# EAGLE schematic IO V1.0 (EAGLE 9.6.2)

## Sheet 1 of 6: BUS
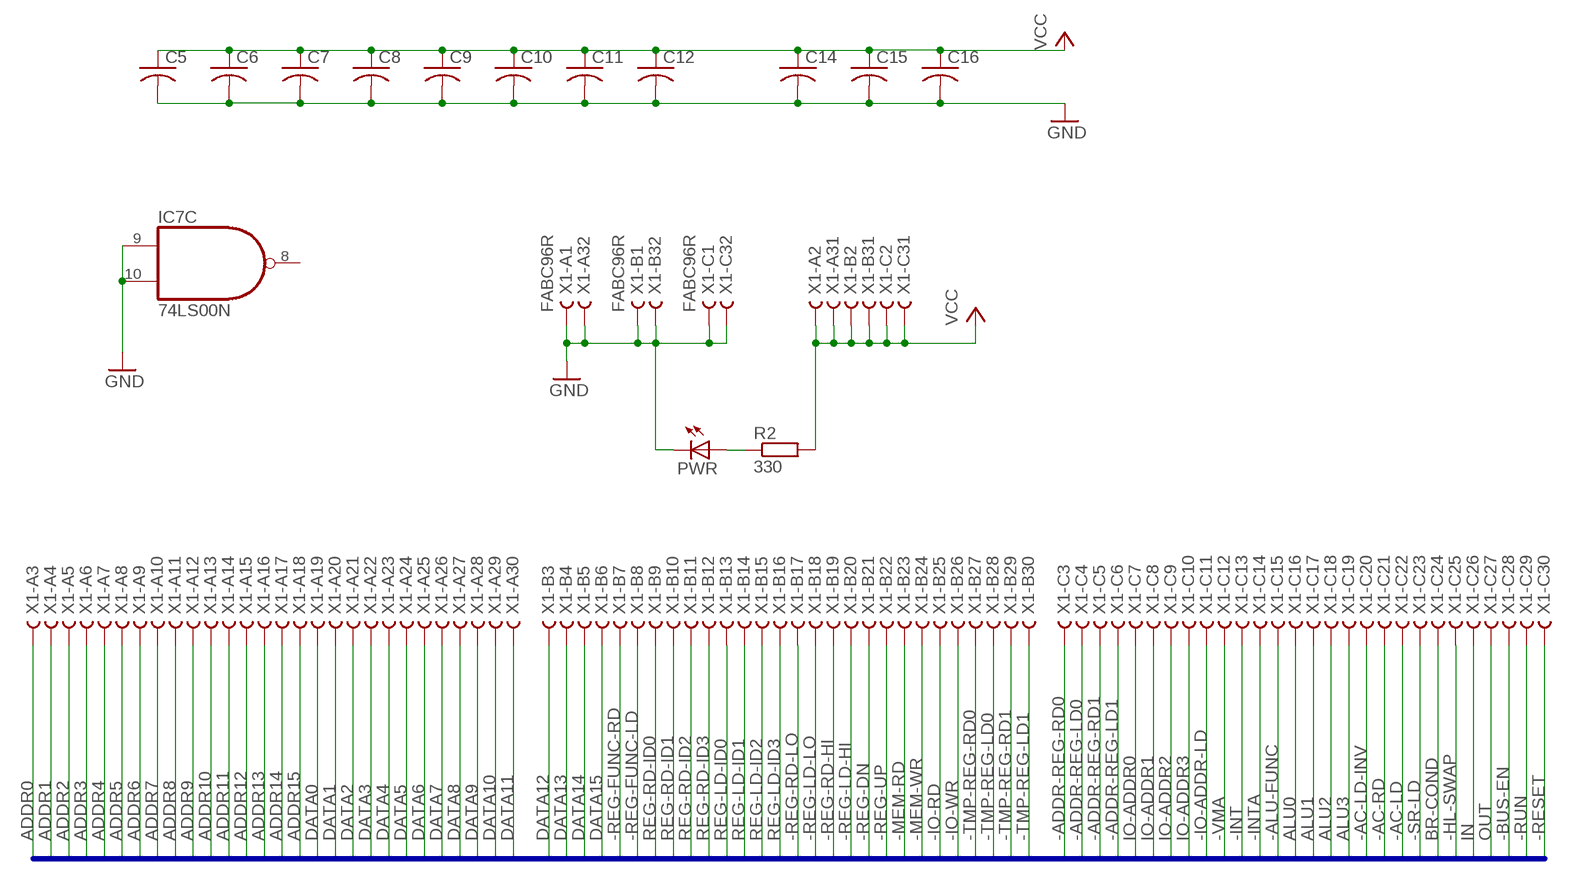
[diagram p0: schematic, sheet 1]

### Parts
C5  C-US025-024X044  [C025-024X044]
C6  C-US025-024X044  [C025-024X044]
C7  C-US025-024X044  [C025-024X044]
C8  C-US025-024X044  [C025-024X044]
C9  C-US025-024X044  [C025-024X044]
C10  C-US025-024X044  [C025-024X044]
C11  C-US025-024X044  [C025-024X044]
C12  C-US025-024X044  [C025-024X044]
C14  C-US025-024X044  [C025-024X044]
C15  C-US025-024X044  [C025-024X044]
C16  C-US025-024X044  [C025-024X044]
IC7  74LS00N  [DIL14]
PWR  LED5MM  [LED5MM]
R2  330  R0207/10  [0207/10]
X1  FABC96R  [FABC96R]

### Nets
-AC-LD: X1.C22
-AC-LD-INV: X1.C20
-AC-RD: X1.C21
-ADDR-REG-LD0: X1.C4
-ADDR-REG-LD1: X1.C6
-ADDR-REG-RD0: X1.C3
-ADDR-REG-RD1: X1.C5
-ALU-FUNC: X1.C15
-BUS-EN: X1.C28
-HL-SWAP: X1.C25
-INT: X1.C13 ; also sheet 2
-INTA: X1.C14
-IO-ADDR-LD: X1.C11
-IO-RD: X1.B25 ; also sheet 6
-IO-WR: X1.B26 ; also sheet 6
-MEM-RD: X1.B23
-MEM-WR: X1.B24
-REG-DN: X1.B21
-REG-FUNC-LD: X1.B8
-REG-FUNC-RD: X1.B7
-REG-LD-HI: X1.B20
-REG-LD-LO: X1.B18
-REG-RD-HI: X1.B19
-REG-RD-LO: X1.B17
-REG-UP: X1.B22
-RESET: X1.C30 ; also sheet 6
-RUN: X1.C29
-SR-LD: X1.C23
-TMP-REG-LD0: X1.B28
-TMP-REG-LD1: X1.B30
-TMP-REG-RD0: X1.B27
-TMP-REG-RD1: X1.B29
-VMA: X1.C12
ADDR0: X1.A3
ADDR1: X1.A4
ADDR2: X1.A5
ADDR3: X1.A6
ADDR4: X1.A7
ADDR5: X1.A8
ADDR6: X1.A9
ADDR7: X1.A10
ADDR8: X1.A11
ADDR9: X1.A12
ADDR10: X1.A13
ADDR11: X1.A14
ADDR12: X1.A15
ADDR13: X1.A16
ADDR14: X1.A17
ADDR15: X1.A18
ALU0: X1.C16
ALU1: X1.C17
ALU2: X1.C18
ALU3: X1.C19
BR-COND: X1.C24
DATA0: X1.A19 ; also sheet 2,3,4,5
DATA1: X1.A20 ; also sheet 2,3,4,5
DATA2: X1.A21 ; also sheet 2,3,4,5
DATA3: X1.A22 ; also sheet 2,3,4,5
DATA4: X1.A23 ; also sheet 2,3,4,5
DATA5: X1.A24 ; also sheet 2,3,4,5
DATA6: X1.A25 ; also sheet 2,3,4,5
DATA7: X1.A26 ; also sheet 2,3,4,5
DATA8: X1.A27
DATA9: X1.A28
DATA10: X1.A29
DATA11: X1.A30
DATA12: X1.B3
DATA13: X1.B4
DATA14: X1.B5
DATA15: X1.B6
GND: C5.2 C6.2 C7.2 C8.2 C9.2 C10.2 C11.2 C12.2 C14.2 C15.2 C16.2 IC7.9(C:I0) IC7.10(C:I1) PWR.K(C) X1.A1 X1.A32 X1.B1 X1.B32 X1.C1 X1.C32 ; also sheet 2,3,4,5
IN: X1.C26 ; also sheet 4
IO-ADDR0: X1.C7 ; also sheet 5
IO-ADDR1: X1.C8 ; also sheet 5
IO-ADDR2: X1.C9 ; also sheet 5
IO-ADDR3: X1.C10 ; also sheet 5
N$11: PWR.A R2.1
OUT: X1.C27 ; also sheet 3
REG-LD-ID0: X1.B13
REG-LD-ID1: X1.B14
REG-LD-ID2: X1.B15
REG-LD-ID3: X1.B16
REG-RD-ID0: X1.B9
REG-RD-ID1: X1.B10
REG-RD-ID2: X1.B11
REG-RD-ID3: X1.B12
VCC: C5.1 C6.1 C7.1 C8.1 C9.1 C10.1 C11.1 C12.1 C14.1 C15.1 C16.1 R2.2 X1.A2 X1.A31 X1.B2 X1.B31 X1.C2 X1.C31 ; also sheet 2,3,4,5,6
Unconnected: IC7.8(C:O)

### Buses
-AC-LD,-AC-LD-INV,-AC-RD,ADDR[0..15],-ADDR-REG-LD[0..1],-ADDR-REG-RD[0..1],ALU[0..3],-ALU-FUNC,BR-COND,-BUS-EN,DATA[0..15],-HL-SWAP,IN,-INT,-INTA,IO-ADDR[0..3],-IO-ADDR-LD,-IO-RD,-IO-WR,-MEM-RD,-MEM-WR,OUT,-REG-DN,-REG-FUNC-LD,-REG-FUNC-RD,-REG-LD-HI,REG-LD-ID[0..3],-REG-LD-LO,-REG-RD-HI,REG-RD-ID[0..3],-REG-RD-LO,-REG-UP,-RESET,-RUN,-SR-LD,-TMP-REG-LD[0..1],-TMP-REG-RD[0..1],-VMA

## Sheet 2 of 6: Serial Interface
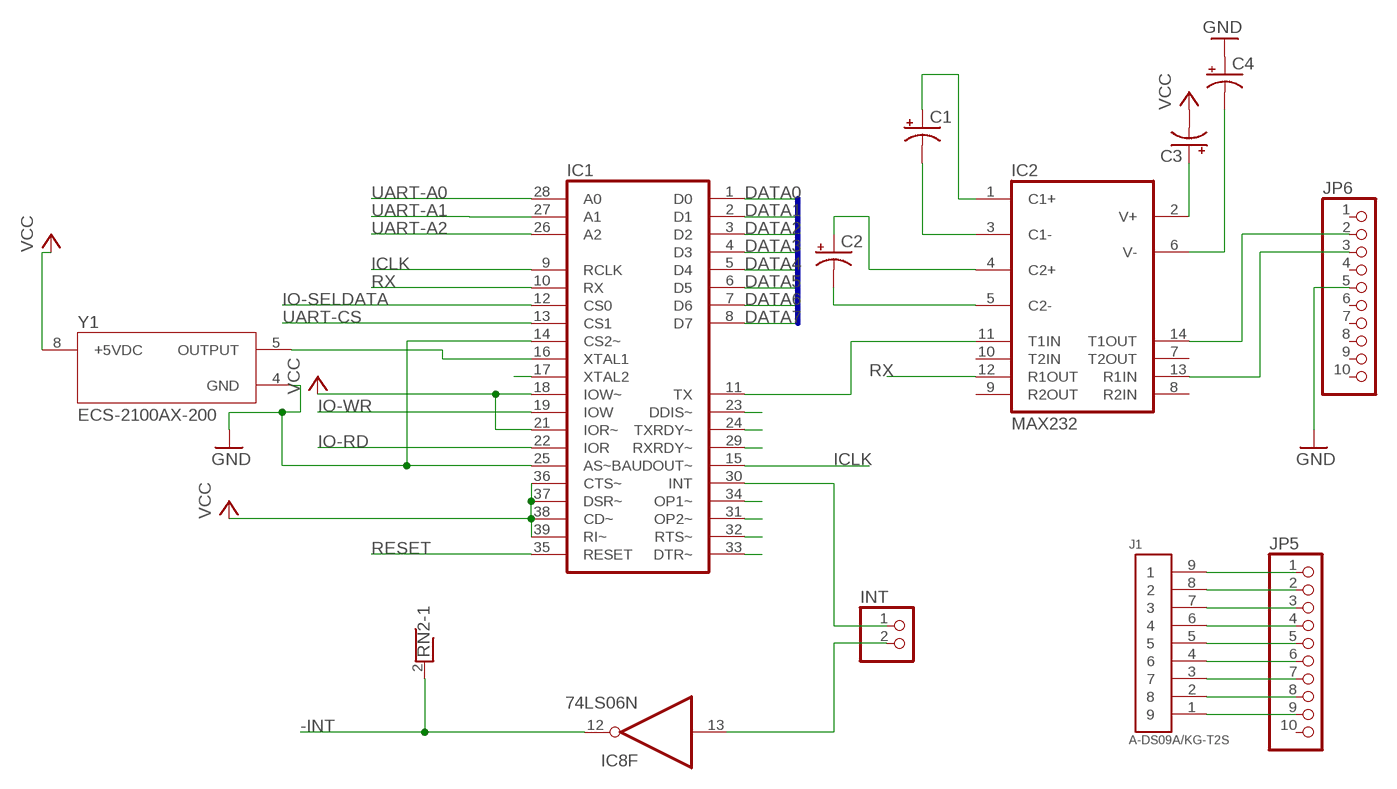
[diagram p1: schematic, sheet 2]

### Parts
C1  CPOL-USE2,5-6E  [E2,5-6E]
C2  CPOL-USE2,5-6E  [E2,5-6E]
C3  CPOL-USE2,5-6E  [E2,5-6E]
C4  CPOL-USE2,5-6E  [E2,5-6E]
IC1  XR-16C550P  [DIL40]
IC2  MAX232  [DIL16]
IC8  74LS06N  [DIL14]
INT  PINHD-1X2  [1X02]
J1  A-DS09A/KG-T2S  [A-DS09A/KG-T2S]
JP5  PINHD-1X10  [1X10]
JP6  PINHD-1X10  [1X10]
RN2  RNX6  [RN-7]
Y1  ECS-2100AX-200  [ECS-2100AX-200]

### Nets
-INT: IC8.12(F:O) RN2.2 ; also sheet 1
DATA0: IC1.1(D0) ; also sheet 1,3,4,5
DATA1: IC1.2(D1) ; also sheet 1,3,4,5
DATA2: IC1.3(D2) ; also sheet 1,3,4,5
DATA3: IC1.4(D3) ; also sheet 1,3,4,5
DATA4: IC1.5(D4) ; also sheet 1,3,4,5
DATA5: IC1.6(D5) ; also sheet 1,3,4,5
DATA6: IC1.7(D6) ; also sheet 1,3,4,5
DATA7: IC1.8(D7) ; also sheet 1,3,4,5
GND: C4.+ IC1.14(CS2~) IC1.25(AS~) JP6.5 Y1.4(GND) ; also sheet 1,3,4,5
ICLK: IC1.9(RCLK) IC1.15(BAUDOUT~)
IO-RD: IC1.22(IOR) ; also sheet 4,6
IO-SELDATA: IC1.12(CS0) ; also sheet 3,4,5
IO-WR: IC1.19(IOW) ; also sheet 3,5,6
N$31: IC1.16(XTAL1) Y1.5(OUTPUT)
N$35: J1.9 JP5.1
N$36: J1.8 JP5.2
N$37: IC1.11(TX) IC2.11(T1IN)
N$38: J1.7 JP5.3
N$39: J1.6 JP5.4
N$42: J1.5 JP5.5
N$43: J1.4 JP5.6
N$45: J1.3 JP5.7
N$47: J1.2 JP5.8
N$48: J1.1 JP5.9
N$49: IC2.14(T1OUT) JP6.2
N$50: IC2.13(R1IN) JP6.3
N$51: C2.- IC2.5(C2-)
N$52: C2.+ IC2.4(C2+)
N$53: IC1.31(OP2~)
N$54: IC1.32(RTS~)
N$55: IC1.33(DTR~)
N$56: IC1.34(OP1~)
N$57: IC1.30(INT) INT.1
N$58: IC1.23(DDIS~)
N$59: IC1.24(TXRDY~)
N$60: IC1.29(RXRDY~)
N$61: IC1.17(XTAL2)
N$62: C1.- IC2.3(C1-)
N$63: C1.+ IC2.1(C1+)
N$64: C3.+ IC2.2(V+)
N$65: C4.- IC2.6(V-)
N$66: IC8.13(F:I) INT.2
RESET: IC1.35(RESET) ; also sheet 6
RX: IC1.10(RX) IC2.12(R1OUT)
UART-A0: IC1.28(A0) ; also sheet 5
UART-A1: IC1.27(A1) ; also sheet 5
UART-A2: IC1.26(A2) ; also sheet 5
UART-CS: IC1.13(CS1) ; also sheet 5
VCC: C3.- IC1.18(IOW~) IC1.21(IOR~) IC1.36(CTS~) IC1.37(DSR~) IC1.38(CD~) IC1.39(RI~) Y1.8(+5VDC) ; also sheet 1,3,4,5,6
Unconnected: IC2.7(T2OUT) IC2.8(R2IN) IC2.9(R2OUT) IC2.10(T2IN) JP5.10 JP6.1 JP6.4 JP6.6 JP6.7 JP6.8 JP6.9 JP6.10

### Buses
DATABUS:DATA[0..15]

## Sheet 3 of 6: Output
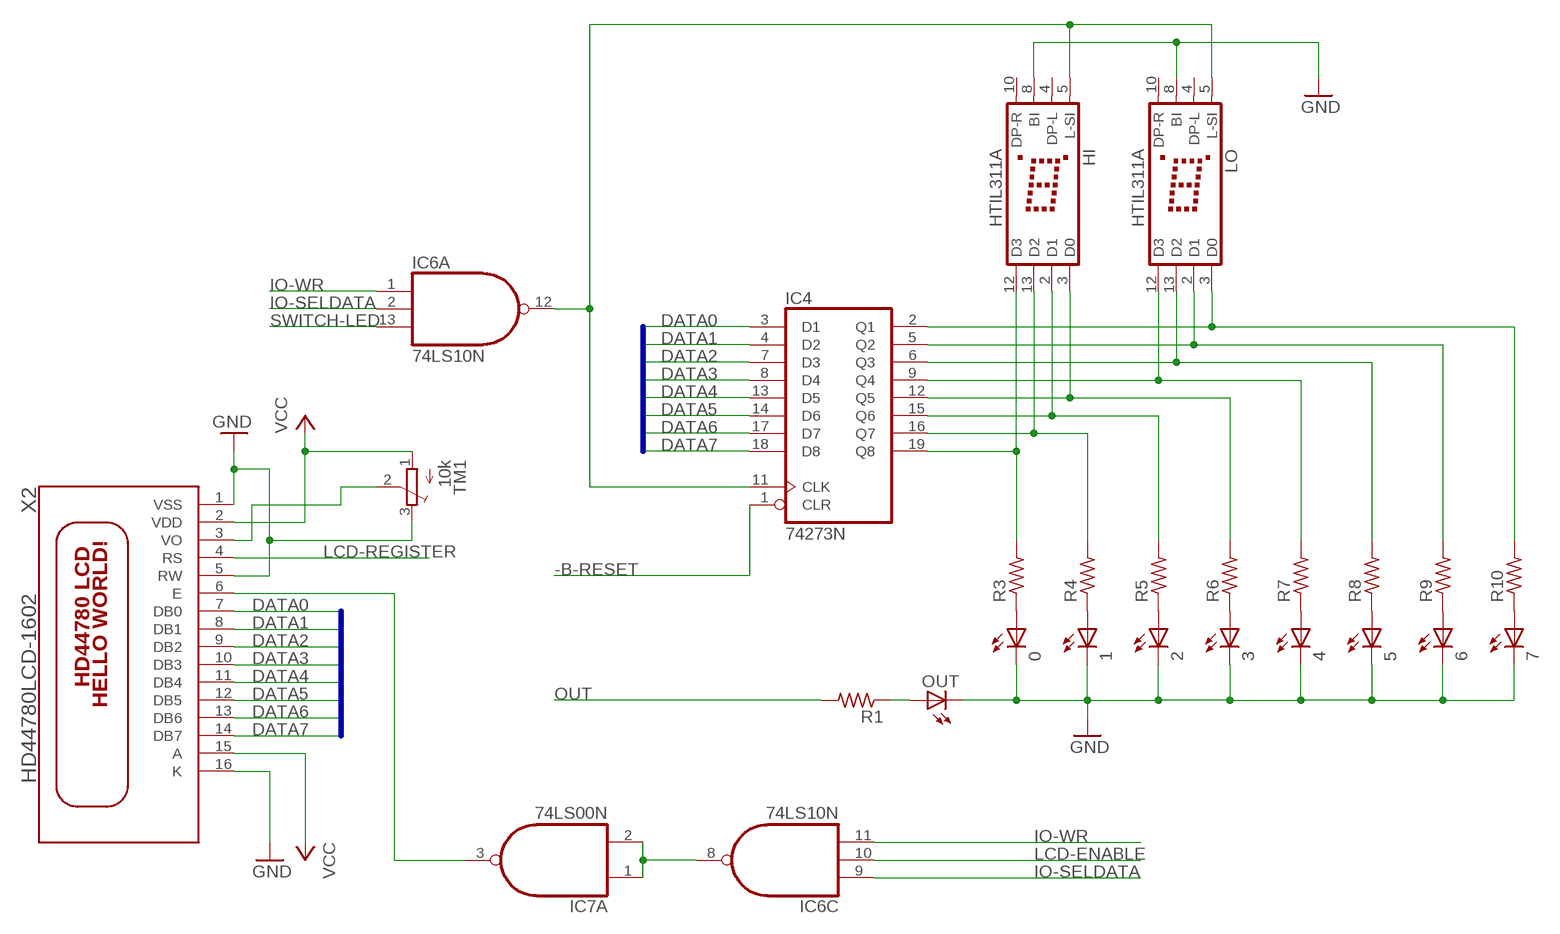
[diagram p2: schematic, sheet 3]

### Parts
0  LED5MM  [LED5MM]
1  LED5MM  [LED5MM]
2  LED5MM  [LED5MM]
3  LED5MM  [LED5MM]
4  LED5MM  [LED5MM]
5  LED5MM  [LED5MM]
6  LED5MM  [LED5MM]
7  LED5MM  [LED5MM]
HI  HTIL311A  [HTIL311A]
IC4  74273N  [DIL20]
IC6  74LS10N  [DIL14]
LO  HTIL311A  [HTIL311A]
OUT  LED5MM  [LED5MM]
R1  R-US_0207/10  [0207/10]
R3  R-US_0207/10  [0207/10]
R4  R-US_0207/10  [0207/10]
R5  R-US_0207/10  [0207/10]
R6  R-US_0207/10  [0207/10]
R7  R-US_0207/10  [0207/10]
R8  R-US_0207/10  [0207/10]
R9  R-US_0207/10  [0207/10]
R10  R-US_0207/10  [0207/10]
TM1  10k  TRIMPOT3386  [TRIM-3386]
X2  HD44780LCD-1602  [LCD1602]

### Nets
-B-RESET: IC4.1(CLR) ; also sheet 5,6
DATA0: IC4.3(D1) X2.7(DB0) ; also sheet 1,2,4,5
DATA1: IC4.4(D2) X2.8(DB1) ; also sheet 1,2,4,5
DATA2: IC4.7(D3) X2.9(DB2) ; also sheet 1,2,4,5
DATA3: IC4.8(D4) X2.10(DB3) ; also sheet 1,2,4,5
DATA4: IC4.13(D5) X2.11(DB4) ; also sheet 1,2,4,5
DATA5: IC4.14(D6) X2.12(DB5) ; also sheet 1,2,4,5
DATA6: IC4.17(D7) X2.13(DB6) ; also sheet 1,2,4,5
DATA7: IC4.18(D8) X2.14(DB7) ; also sheet 1,2,4,5
GND: 0.K(C) 1.K(C) 2.K(C) 3.K(C) 4.K(C) 5.K(C) 6.K(C) 7.K(C) HI.8(BI) LO.8(BI) OUT.K(C) TM1.3(E) X2.1(VSS) X2.5(RW) X2.16(K) ; also sheet 1,2,4,5
IO-SELDATA: IC6.2(A:I1) IC6.9(C:I0) ; also sheet 2,4,5
IO-WR: IC6.1(A:I0) IC6.11(C:I2) ; also sheet 2,5,6
LCD-ENABLE: IC6.10(C:I1) ; also sheet 5
LCD-REGISTER: X2.4(RS) ; also sheet 5
N$9: OUT.A R1.1
N$10: 2.A R5.1
N$12: 3.A R6.1
N$13: 4.A R7.1
N$14: 0.A R3.1
N$15: 1.A R4.1
N$16: 5.A R8.1
N$17: 7.A R10.1
N$18: 6.A R9.1
N$19: HI.12(D3) IC4.19(Q8) R3.2
N$20: HI.13(D2) IC4.16(Q7) R4.2
N$21: HI.2(D1) IC4.15(Q6) R5.2
N$22: HI.3(D0) IC4.12(Q5) R6.2
N$23: IC4.9(Q4) LO.12(D3) R7.2
N$24: IC4.6(Q3) LO.13(D2) R8.2
N$25: IC4.5(Q2) LO.2(D1) R9.2
N$26: IC4.2(Q1) LO.3(D0) R10.2
N$28: HI.5(L-SI) IC4.11(CLK) IC6.12(A:O) LO.5(L-SI)
N$30: IC7.3(A:O) X2.6(E)
N$33: IC6.8(C:O) IC7.1(A:I0) IC7.2(A:I1)
N$44: TM1.2(S) X2.3(VO)
OUT: R1.2 ; also sheet 1
SWITCH-LED: IC6.13(A:I2) ; also sheet 4,5
VCC: TM1.1(A) X2.2(VDD) X2.15(A) ; also sheet 1,2,4,5,6
Unconnected: HI.1(LEDSUP) HI.4(DP-L) HI.10(DP-R) LO.1(LEDSUP) LO.4(DP-L) LO.10(DP-R)

### Buses
DATABUS:DATA[0..15]

## Sheet 4 of 6: Input
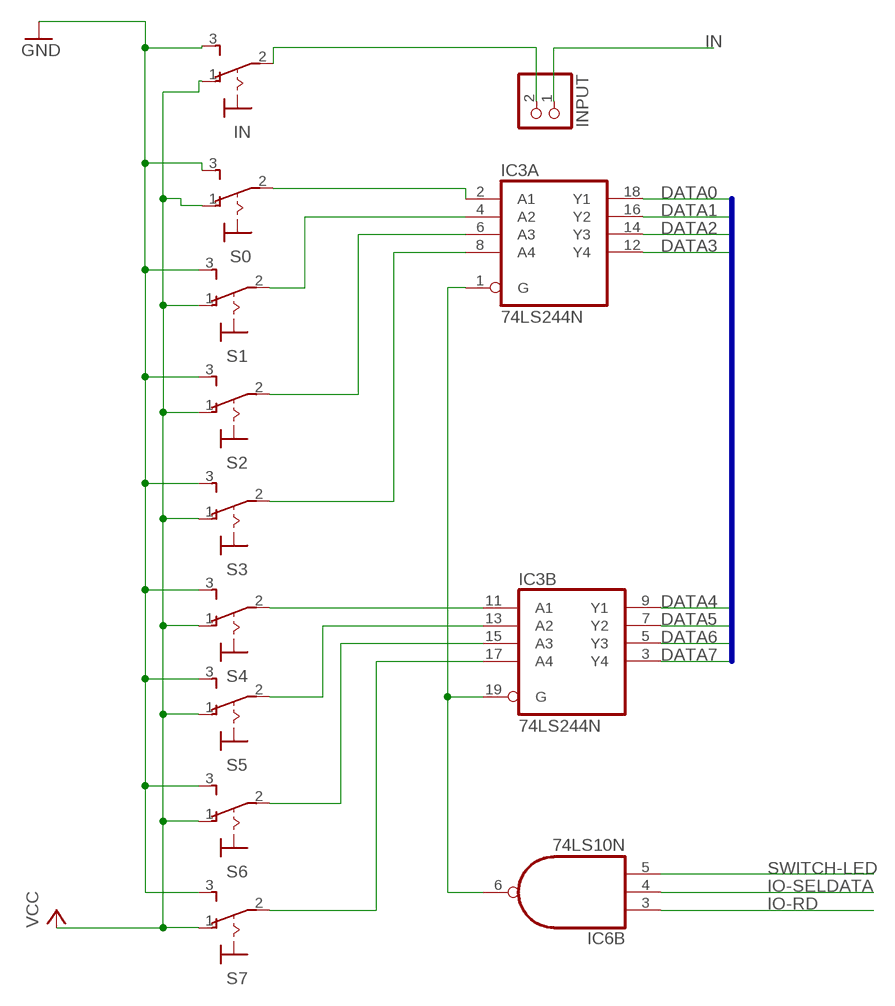
[diagram p3: schematic, sheet 4]

### Parts
IC3  74LS244N  [DIL20]
IN  M9040P  [M9040P]
INPUT  PINHD-1X2  [1X02]
S0  M9040P  [M9040P]
S1  M9040P  [M9040P]
S2  M9040P  [M9040P]
S3  M9040P  [M9040P]
S4  M9040P  [M9040P]
S5  M9040P  [M9040P]
S6  M9040P  [M9040P]
S7  M9040P  [M9040P]

### Nets
DATA0: IC3.18(A:Y1) ; also sheet 1,2,3,5
DATA1: IC3.16(A:Y2) ; also sheet 1,2,3,5
DATA2: IC3.14(A:Y3) ; also sheet 1,2,3,5
DATA3: IC3.12(A:Y4) ; also sheet 1,2,3,5
DATA4: IC3.9(B:Y1) ; also sheet 1,2,3,5
DATA5: IC3.7(B:Y2) ; also sheet 1,2,3,5
DATA6: IC3.5(B:Y3) ; also sheet 1,2,3,5
DATA7: IC3.3(B:Y4) ; also sheet 1,2,3,5
GND: IN.3(S) S0.3(S) S1.3(S) S2.3(S) S3.3(S) S4.3(S) S5.3(S) S6.3(S) S7.3(S) ; also sheet 1,2,3,5
IN: INPUT.1 ; also sheet 1
IO-RD: IC6.3(B:I0) ; also sheet 2,6
IO-SELDATA: IC6.4(B:I1) ; also sheet 2,3,5
N$1: IC3.2(A:A1) S0.2(P)
N$2: IC3.4(A:A2) S1.2(P)
N$3: IC3.6(A:A3) S2.2(P)
N$4: IC3.8(A:A4) S3.2(P)
N$5: IC3.11(B:A1) S4.2(P)
N$6: IC3.13(B:A2) S5.2(P)
N$7: IC3.15(B:A3) S6.2(P)
N$8: IC3.17(B:A4) S7.2(P)
N$32: IC3.1(A:G) IC3.19(B:G) IC6.6(B:O)
N$34: IN.2(P) INPUT.2
SWITCH-LED: IC6.5(B:I2) ; also sheet 3,5
VCC: IN.1(O) S0.1(O) S1.1(O) S2.1(O) S3.1(O) S4.1(O) S5.1(O) S6.1(O) S7.1(O) ; also sheet 1,2,3,5,6

### Buses
DATABUS:DATA[0..15]

## Sheet 5 of 6: Board Select logic
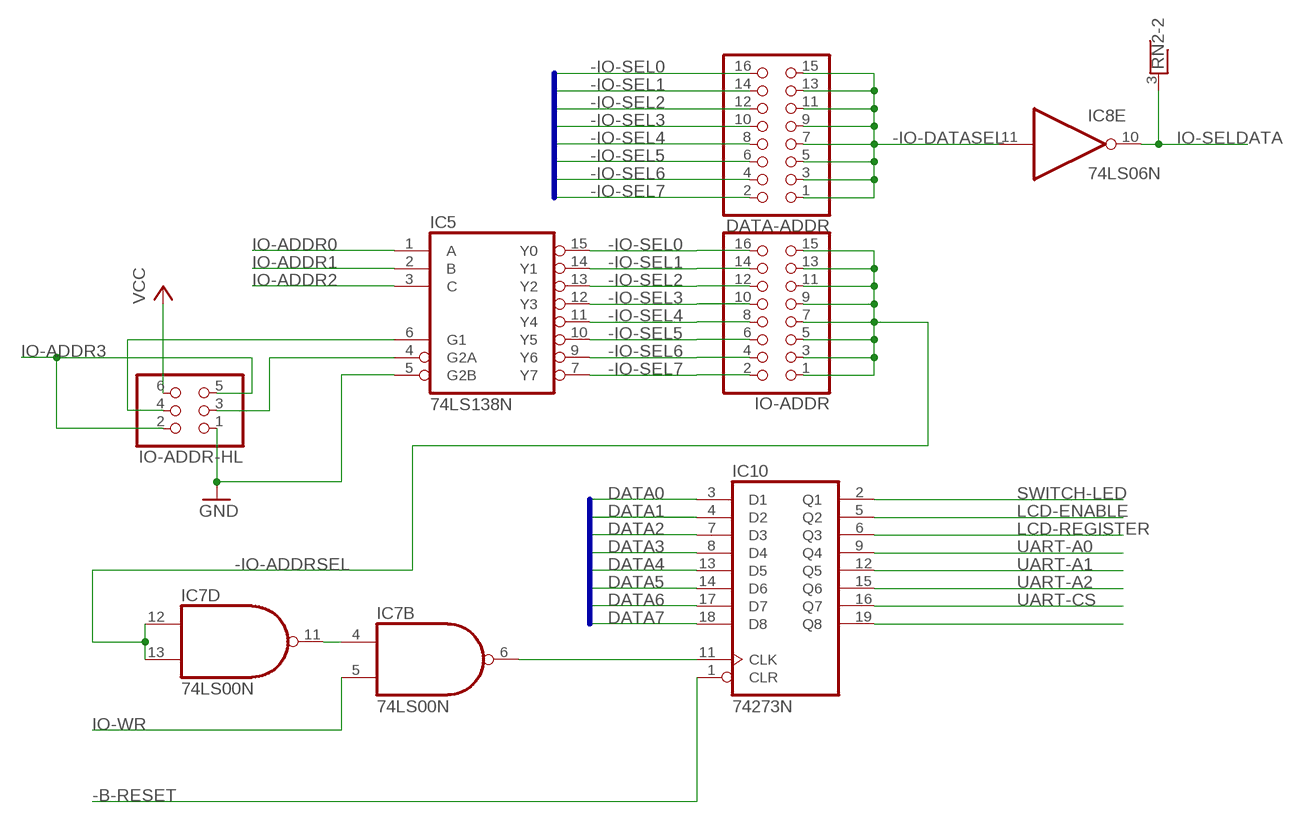
[diagram p4: schematic, sheet 5]

### Parts
DATA-ADDR  PINHD-2X8  [2X08]
IC5  74LS138N  [DIL16]
IC10  74273N  [DIL20]
IO-ADDR  PINHD-2X8  [2X08]
IO-ADDR-HL  PINHD-2X3  [2X03]

### Nets
-B-RESET: IC10.1(CLR) ; also sheet 3,6
-IO-ADDRSEL: IC7.12(D:I0) IC7.13(D:I1) IO-ADDR.1 IO-ADDR.3 IO-ADDR.5 IO-ADDR.7 IO-ADDR.9 IO-ADDR.11 IO-ADDR.13 IO-ADDR.15
-IO-DATASEL: DATA-ADDR.1 DATA-ADDR.3 DATA-ADDR.5 DATA-ADDR.7 DATA-ADDR.9 DATA-ADDR.11 DATA-ADDR.13 DATA-ADDR.15 IC8.11(E:I)
-IO-SEL0: DATA-ADDR.16 IC5.15(Y0) IO-ADDR.16
-IO-SEL1: DATA-ADDR.14 IC5.14(Y1) IO-ADDR.14
-IO-SEL2: DATA-ADDR.12 IC5.13(Y2) IO-ADDR.12
-IO-SEL3: DATA-ADDR.10 IC5.12(Y3) IO-ADDR.10
-IO-SEL4: DATA-ADDR.8 IC5.11(Y4) IO-ADDR.8
-IO-SEL5: DATA-ADDR.6 IC5.10(Y5) IO-ADDR.6
-IO-SEL6: DATA-ADDR.4 IC5.9(Y6) IO-ADDR.4
-IO-SEL7: DATA-ADDR.2 IC5.7(Y7) IO-ADDR.2
DATA0: IC10.3(D1) ; also sheet 1,2,3,4
DATA1: IC10.4(D2) ; also sheet 1,2,3,4
DATA2: IC10.7(D3) ; also sheet 1,2,3,4
DATA3: IC10.8(D4) ; also sheet 1,2,3,4
DATA4: IC10.13(D5) ; also sheet 1,2,3,4
DATA5: IC10.14(D6) ; also sheet 1,2,3,4
DATA6: IC10.17(D7) ; also sheet 1,2,3,4
DATA7: IC10.18(D8) ; also sheet 1,2,3,4
GND: IC5.5(G2B) IO-ADDR-HL.1 ; also sheet 1,2,3,4
IO-ADDR0: IC5.1(A) ; also sheet 1
IO-ADDR1: IC5.2(B) ; also sheet 1
IO-ADDR2: IC5.3(C) ; also sheet 1
IO-ADDR3: IO-ADDR-HL.2 IO-ADDR-HL.5 ; also sheet 1
IO-SELDATA: IC8.10(E:O) RN2.3 ; also sheet 2,3,4
IO-WR: IC7.5(B:I1) ; also sheet 2,3,6
LCD-ENABLE: IC10.5(Q2) ; also sheet 3
LCD-REGISTER: IC10.6(Q3) ; also sheet 3
N$27: IC5.4(G2A) IO-ADDR-HL.3
N$29: IC5.6(G1) IO-ADDR-HL.4
N$40: IC7.6(B:O) IC10.11(CLK)
N$46: IC10.19(Q8)
N$67: IC7.4(B:I0) IC7.11(D:O)
SWITCH-LED: IC10.2(Q1) ; also sheet 3,4
UART-A0: IC10.9(Q4) ; also sheet 2
UART-A1: IC10.12(Q5) ; also sheet 2
UART-A2: IC10.15(Q6) ; also sheet 2
UART-CS: IC10.16(Q7) ; also sheet 2
VCC: IO-ADDR-HL.6 ; also sheet 1,2,3,4,6

### Buses
DATABUS:DATA[0..15]
-IO-ADDRSEL,-IO-SEL0,-IO-SEL1,-IO-SEL2,-IO-SEL3,-IO-SEL4,-IO-SEL5,-IO-SEL6,-IO-SEL7

## Sheet 6 of 6: Bus Buffering
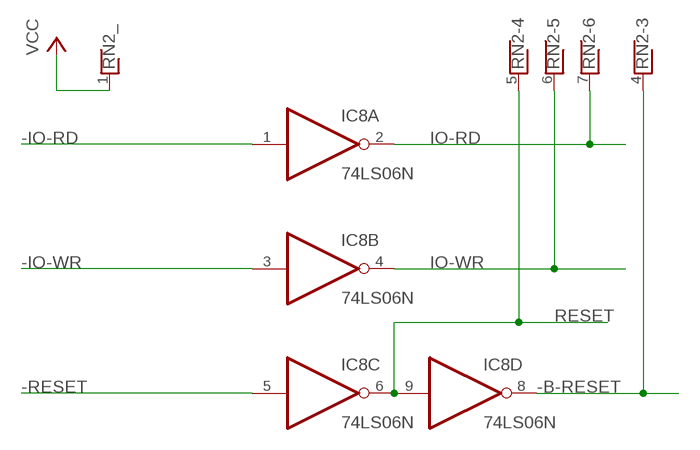
[diagram p5: schematic, sheet 6]

### Nets
-B-RESET: IC8.8(D:O) RN2.4 ; also sheet 3,5
-IO-RD: IC8.1(A:I) ; also sheet 1
-IO-WR: IC8.3(B:I) ; also sheet 1
-RESET: IC8.5(C:I) ; also sheet 1
IO-RD: IC8.2(A:O) RN2.7 ; also sheet 2,4
IO-WR: IC8.4(B:O) RN2.6 ; also sheet 2,3,5
RESET: IC8.6(C:O) IC8.9(D:I) RN2.5 ; also sheet 2
VCC: RN2.1 ; also sheet 1,2,3,4,5

## Power pins joined to a net without a drawn wire
GND: HI.7(GND) IC1.20(GND) IC2.15(GND) IC3.10(P:GND) IC4.10(GND) IC5.8(GND) IC6.7(P:GND) IC7.7(P:GND) IC8.7(P:GND) IC10.10(GND) LO.7(GND)
VCC: HI.14(VCC) IC1.40(VCC) IC2.16(VCC) IC3.20(P:VCC) IC4.20(VCC) IC5.16(VCC) IC6.14(P:VCC) IC7.14(P:VCC) IC8.14(P:VCC) IC10.20(VCC) LO.14(VCC)

## Library data of the parts
0 1-7 OUT = adafruit:LED: LED
C1-C4 = rcl:CPOL-US: POLARIZED CAPACITOR, American symbol; SPICEPREFIX: C
C5-C12 C14-C16 = adafruit:C-US: CAPACITOR, American symbol
DATA-ADDR IO-ADDR = pinhead:PINHD-2X8: PIN HEADER
HI LO = display-hp:HTIL311A: LED DISPLAY 1-character dot matrix, 2 decimal points Internal TTL MSI IC with Latch, Decoder, and Driver Source: http://www.taosinc.com .. til311-e6.pdf; OC_FARNELL: unknown; OC_NEWARK: unknown
IC1 = exar:XR-16C550P: UART/FIFO; MPN: ST16C450CP40; OC_FARNELL: 1294801; OC_NEWARK: 24R1445
IC2 = maxim:MAX232: RS232 TRANSCEIVER; MF: MAXIM; MPN: MAX232ACPE+; OC_FARNELL: 9723773; OC_NEWARK: 68K4544
IC3 = 74xx-us:74*244: Octal BUFFER and LINE DRIVER, 3-state
IC4 IC10 = 74xx-us:74*273: Octal D type FLIP FLOP, clear
IC5 = 74xx-us:74*138: 3-line to 8-line DECODER/DEMULTIPLEXER
IC6 = 74xx-us:74*10: Triple 3-input NAND gate
IC7 = 74xx-us:74*00: Quad 2-input NAND gate
IC8 = 74xx-us:74*06: Hex INVERTER, open collector high-voltage output
IN S0 S1-S7 = switch:M9040P: TOGGLE SWITCH Marquardt
INPUT INT = pinhead:PINHD-1X2: PIN HEADER
IO-ADDR-HL = pinhead:PINHD-2X3: PIN HEADER
J1 = D-Sub Connectors:A-DS09A/KG-T2S: CONN D-SUB PLUG 9POS R/A SOLDER Manufacturer's datasheet <http://www.assmann-wsw.com/fileadmin/datasheets/ASS_4888_CO.pdf>; CREATEDBY: PCBLayout.com; DIGI_KEY_PART_NUMBER: AE10968-ND; MANUFACTURER: Assmann WSW Components; MPN: A-DS 09 A/KG-T2S
JP5 JP6 = pinhead:PINHD-1X10: PIN HEADER
PWR = led:LED: LED
R1 R3-R10 = rcl:R-US_: RESISTOR, American symbol; SPICEPREFIX: R
R2 = eagle-ltspice:R: RESISTOR, European symbol; SPICEMODEL: NONE; SPICEPREFIX: R
RN2 = resistor-net:RNX6: RESISTOR NETWORK; OC_FARNELL: unknown; OC_NEWARK: unknown
TM1 = adafruit:TRIMPOT: SMT trimmer potentiometer part number TC33X http://www.ladyada.net/library/eagle
X1 = con-vg:FABC96R: CONNECTOR female, 96 pins, type R, rows ABC, grid 2.54 mm
X2 = adafruit:HD44780LCD: HD44780 LCD Standard character type LCDs, available in sizes from 8x1 to 40x4!
Y1 = Crystals_Oscillators:ECS-2100AX-200: XTAL OSC XO 20.0000MHZ HCMOS TTL Manufacturer's datasheet <https://ecsxtal.com/store/pdf/ecs-2100x.pdf>; CREATED_BY: PCBLayout.com; DIGIKEY_PART_NUMBER: X964-ND; MANUFACTURER: ECS Inc.; MPN: ECS-2100AX-200; PACKAGE: 8-DIP

## Net classes
1 GND: width 1 mm
2 5V: width 1 mm